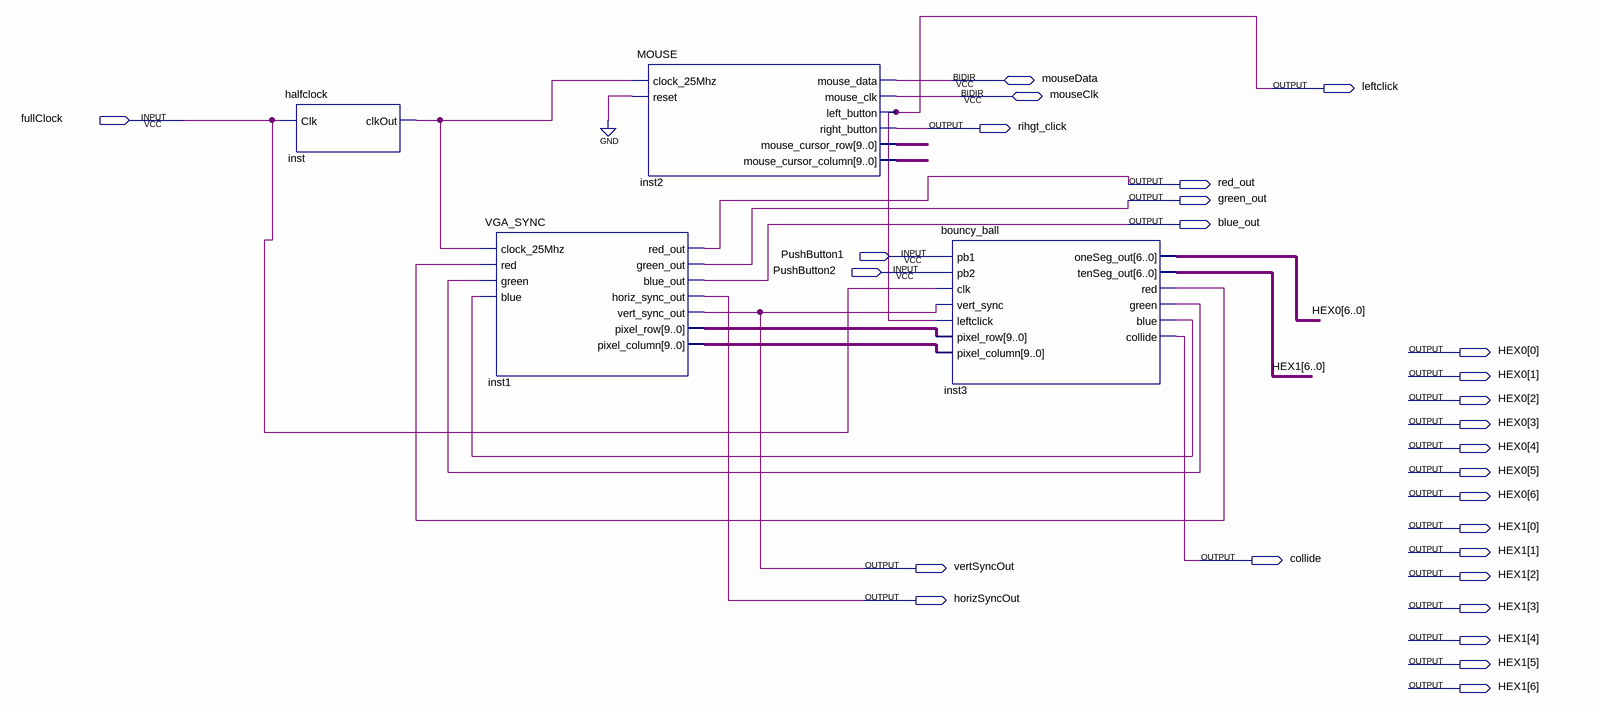
[diagram p0: schematic sheet]
// Quartus schematic bouncy_test_v1.bdf as structural Verilog: 4 symbols, 27 pins
module bouncy_test_v1 (
  input  fullClock,
  input  PushButton1,
  input  PushButton2,
  inout  mouseData,
  inout  mouseClk,
  output leftclick,
  output rihgt_click,
  output red_out,
  output green_out,
  output blue_out,
  output [6:0] HEX0,
  output [6:0] HEX1,
  output collide,
  output vertSyncOut,
  output horizSyncOut
);

  wire inst3_blue, inst3_green, inst3_red, inst_clkout;
  wire [9:0] inst1_pixel_column, inst1_pixel_row, inst2_mouse_cursor_column, inst2_mouse_cursor_row;

  halfclock inst (.Clk(fullClock), .clkOut(inst_clkout));
  VGA_SYNC inst1 (
    .clock_25Mhz(inst_clkout), .red(inst3_red), .green(inst3_green), .blue(inst3_blue), .red_out(red_out),
    .green_out(green_out), .blue_out(blue_out), .horiz_sync_out(horizSyncOut), .vert_sync_out(vertSyncOut),
    .pixel_row(inst1_pixel_row), .pixel_column(inst1_pixel_column));
  MOUSE inst2 (
    .clock_25Mhz(inst_clkout), .reset(1'b0), .left_button(leftclick), .right_button(rihgt_click),
    .mouse_cursor_row(inst2_mouse_cursor_row), .mouse_cursor_column(inst2_mouse_cursor_column),
    .mouse_data(mouseData), .mouse_clk(mouseClk));
  bouncy_ball inst3 (
    .pb2(PushButton2), .clk(fullClock), .vert_sync(vertSyncOut), .leftclick(leftclick),
    .pixel_row(inst1_pixel_row), .pixel_column(inst1_pixel_column), .oneSeg_out(HEX0), .tenSeg_out(HEX1),
    .red(inst3_red), .green(inst3_green), .blue(inst3_blue), .collide(collide));  // open: pb1
endmodule
